# EAGLE schematic board (EAGLE 8.6.0)
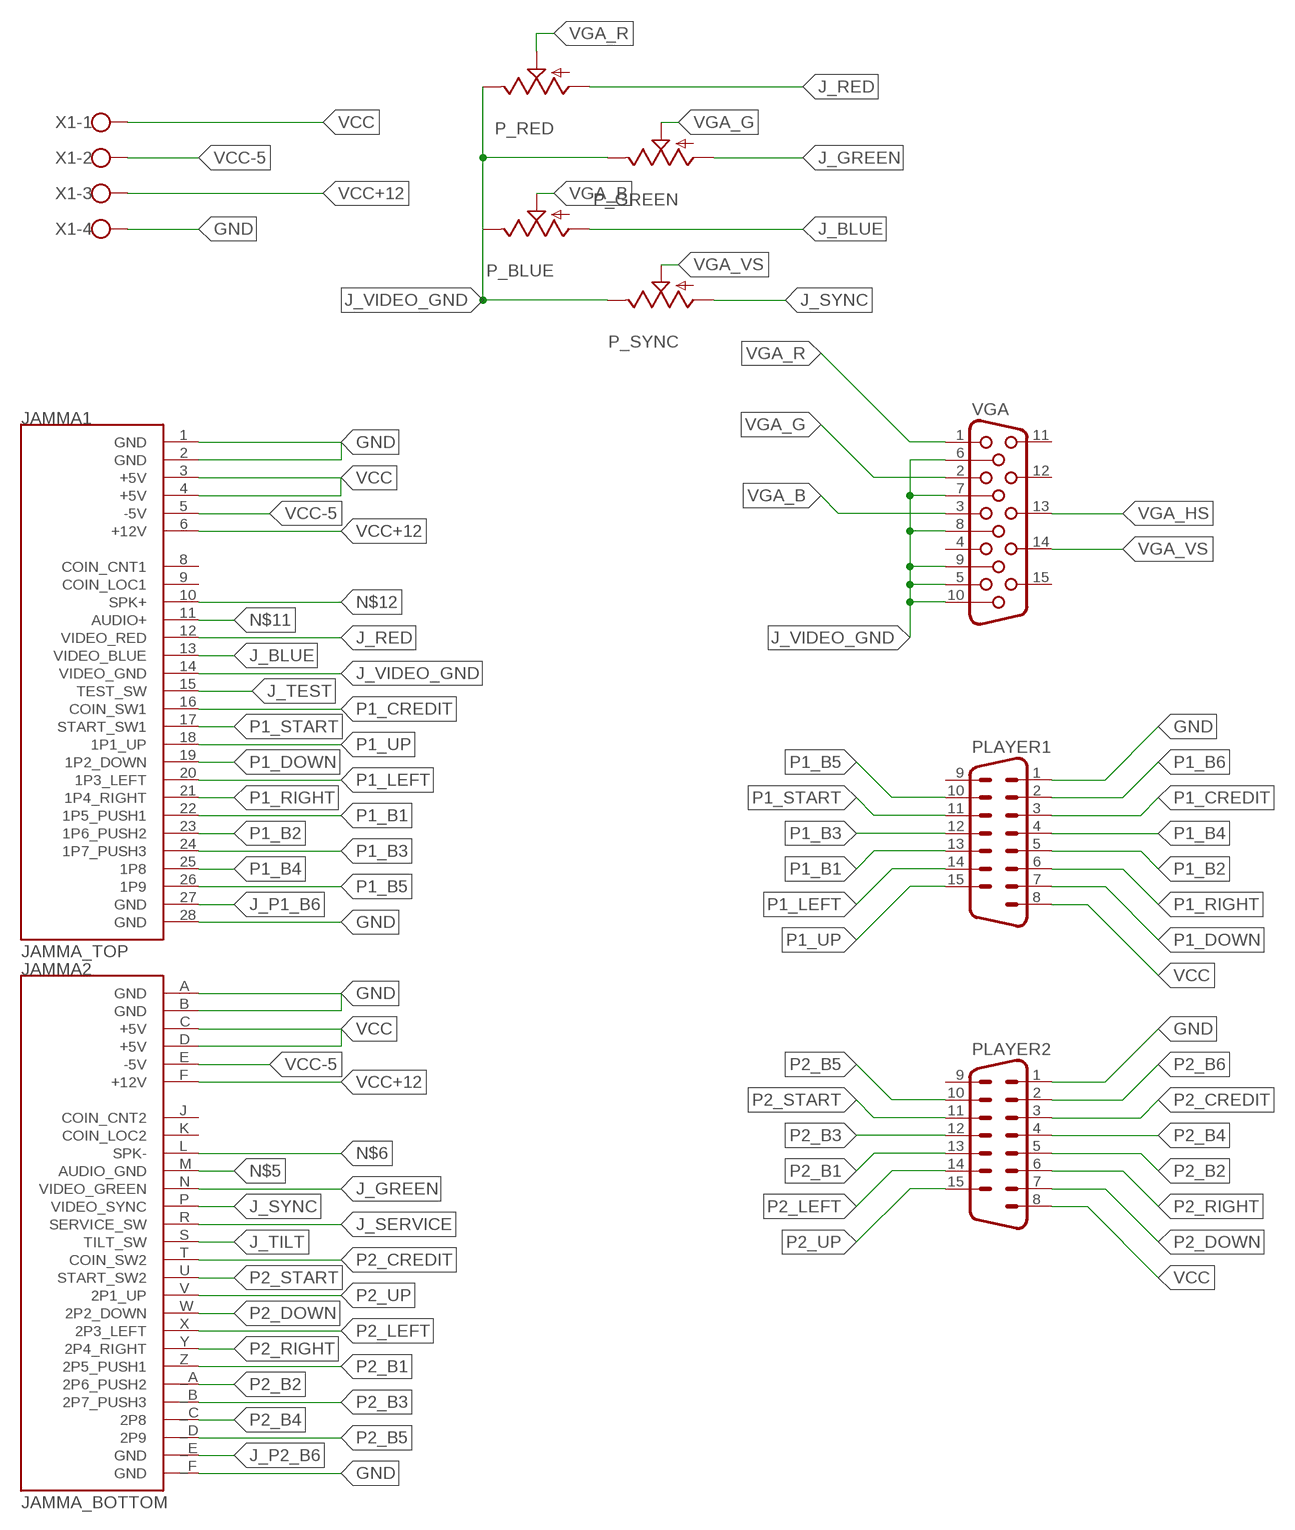
[diagram p0: schematic, sheet 1]

## Parts
JAMMA1  JAMMA_TOP  [JAMMA_TOP]
JAMMA2  JAMMA_BOTTOM  [JAMMA_BOTTOM]
P_BLUE  TRIM_US-B25P  [B25P]
P_GREEN  TRIM_US-B25P  [B25P]
P_RED  TRIM_US-B25P  [B25P]
P_SYNC  TRIM_US-B25P  [B25P]
PLAYER1  M15VB  [M15VB]
PLAYER2  M15VB  [M15VB]
VGA  HF15H  [HDF15H]
X1  W237-4  [W237-4]

## Nets
GND: JAMMA1.1(GND) JAMMA1.2(GND) JAMMA1.28(GND) JAMMA2._F(GND) JAMMA2.A(GND) JAMMA2.B(GND) PLAYER1.1 PLAYER2.1 X1.4
J_BLUE: JAMMA1.13(VIDEO_BLUE) P_BLUE.A
J_GREEN: JAMMA2.N(VIDEO_GREEN) P_GREEN.A
J_P1_B6: JAMMA1.27(GND)
J_P2_B6: JAMMA2._E(GND)
J_RED: JAMMA1.12(VIDEO_RED) P_RED.A
J_SERVICE: JAMMA2.R(SERVICE_SW)
J_SYNC: JAMMA2.P(VIDEO_SYNC) P_SYNC.A
J_TEST: JAMMA1.15(TEST_SW)
J_TILT: JAMMA2.S(TILT_SW)
J_VIDEO_GND: JAMMA1.14(VIDEO_GND) P_BLUE.E P_GREEN.E P_RED.E P_SYNC.E VGA.5 VGA.6 VGA.7 VGA.8 VGA.9 VGA.10
N$5: JAMMA2.M(AUDIO_GND)
N$6: JAMMA2.L(SPK-)
N$11: JAMMA1.11(AUDIO+)
N$12: JAMMA1.10(SPK+)
P1_B1: JAMMA1.22(1P5_PUSH1) PLAYER1.13
P1_B2: JAMMA1.23(1P6_PUSH2) PLAYER1.5
P1_B3: JAMMA1.24(1P7_PUSH3) PLAYER1.12
P1_B4: JAMMA1.25(1P8) PLAYER1.4
P1_B5: JAMMA1.26(1P9) PLAYER1.10
P1_B6: PLAYER1.2
P1_CREDIT: JAMMA1.16(COIN_SW1) PLAYER1.3
P1_DOWN: JAMMA1.19(1P2_DOWN) PLAYER1.7
P1_LEFT: JAMMA1.20(1P3_LEFT) PLAYER1.14
P1_RIGHT: JAMMA1.21(1P4_RIGHT) PLAYER1.6
P1_START: JAMMA1.17(START_SW1) PLAYER1.11
P1_UP: JAMMA1.18(1P1_UP) PLAYER1.15
P2_B1: JAMMA2.Z(2P5_PUSH1) PLAYER2.13
P2_B2: JAMMA2._A(2P6_PUSH2) PLAYER2.5
P2_B3: JAMMA2._B(2P7_PUSH3) PLAYER2.12
P2_B4: JAMMA2._C(2P8) PLAYER2.4
P2_B5: JAMMA2._D(2P9) PLAYER2.10
P2_B6: PLAYER2.2
P2_CREDIT: JAMMA2.T(COIN_SW2) PLAYER2.3
P2_DOWN: JAMMA2.W(2P2_DOWN) PLAYER2.7
P2_LEFT: JAMMA2.X(2P3_LEFT) PLAYER2.14
P2_RIGHT: JAMMA2.Y(2P4_RIGHT) PLAYER2.6
P2_START: JAMMA2.U(START_SW2) PLAYER2.11
P2_UP: JAMMA2.V(2P1_UP) PLAYER2.15
VCC: JAMMA1.3(+5V) JAMMA1.4(+5V) JAMMA2.C(+5V) JAMMA2.D(+5V) PLAYER1.8 PLAYER2.8 X1.1
VCC+12: JAMMA1.6(+12V) JAMMA2.F(+12V) X1.3
VCC-5: JAMMA1.5(-5V) JAMMA2.E(-5V) X1.2
VGA_B: P_BLUE.S VGA.3
VGA_G: P_GREEN.S VGA.2
VGA_HS: VGA.13
VGA_R: P_RED.S VGA.1
VGA_VS: P_SYNC.S VGA.14
Unconnected: JAMMA1.8(COIN_CNT1) JAMMA1.9(COIN_LOC1) JAMMA2.J(COIN_CNT2) JAMMA2.K(COIN_LOC2) PLAYER1.9 PLAYER2.9 VGA.4 VGA.11 VGA.12 VGA.15

## Library data of the parts
JAMMA1 = JAMMA:JAMMA_TOP: JAMMA Connector Top Parts side for these card-edge connenctors HIROSE CR7E-56DA-3.96E HIROSE CR7E-56DB-3.96E KEL 1168-056-009
JAMMA2 = JAMMA:JAMMA_BOTTOM: JAMMA Connector Bottom Solder side for these card-edge connenctors HIROSE CR7E-56DA-3.96E HIROSE CR7E-56DB-3.96E KEL 1168-056-009
P_BLUE P_GREEN P_RED P_SYNC = pot:TRIM_US-: POTENTIOMETER
PLAYER1 PLAYER2 = con-subd:M15: SUB-D; OC_FARNELL: unknown; OC_NEWARK: unknown
VGA = con-subd:HF15: SUB-D; OC_FARNELL: unknown; OC_NEWARK: unknown
X1 = con-wago-500:W237-4: WAGO SCREW CLAMP; OC_FARNELL: unknown; OC_NEWARK: unknown